# EasyEDA Pro project ProPrj_OSBDM_HPM5301_2024-08-18.epro

# Schematic OSBDM_HPM5301
Board Name: OSBDM_HPM5301
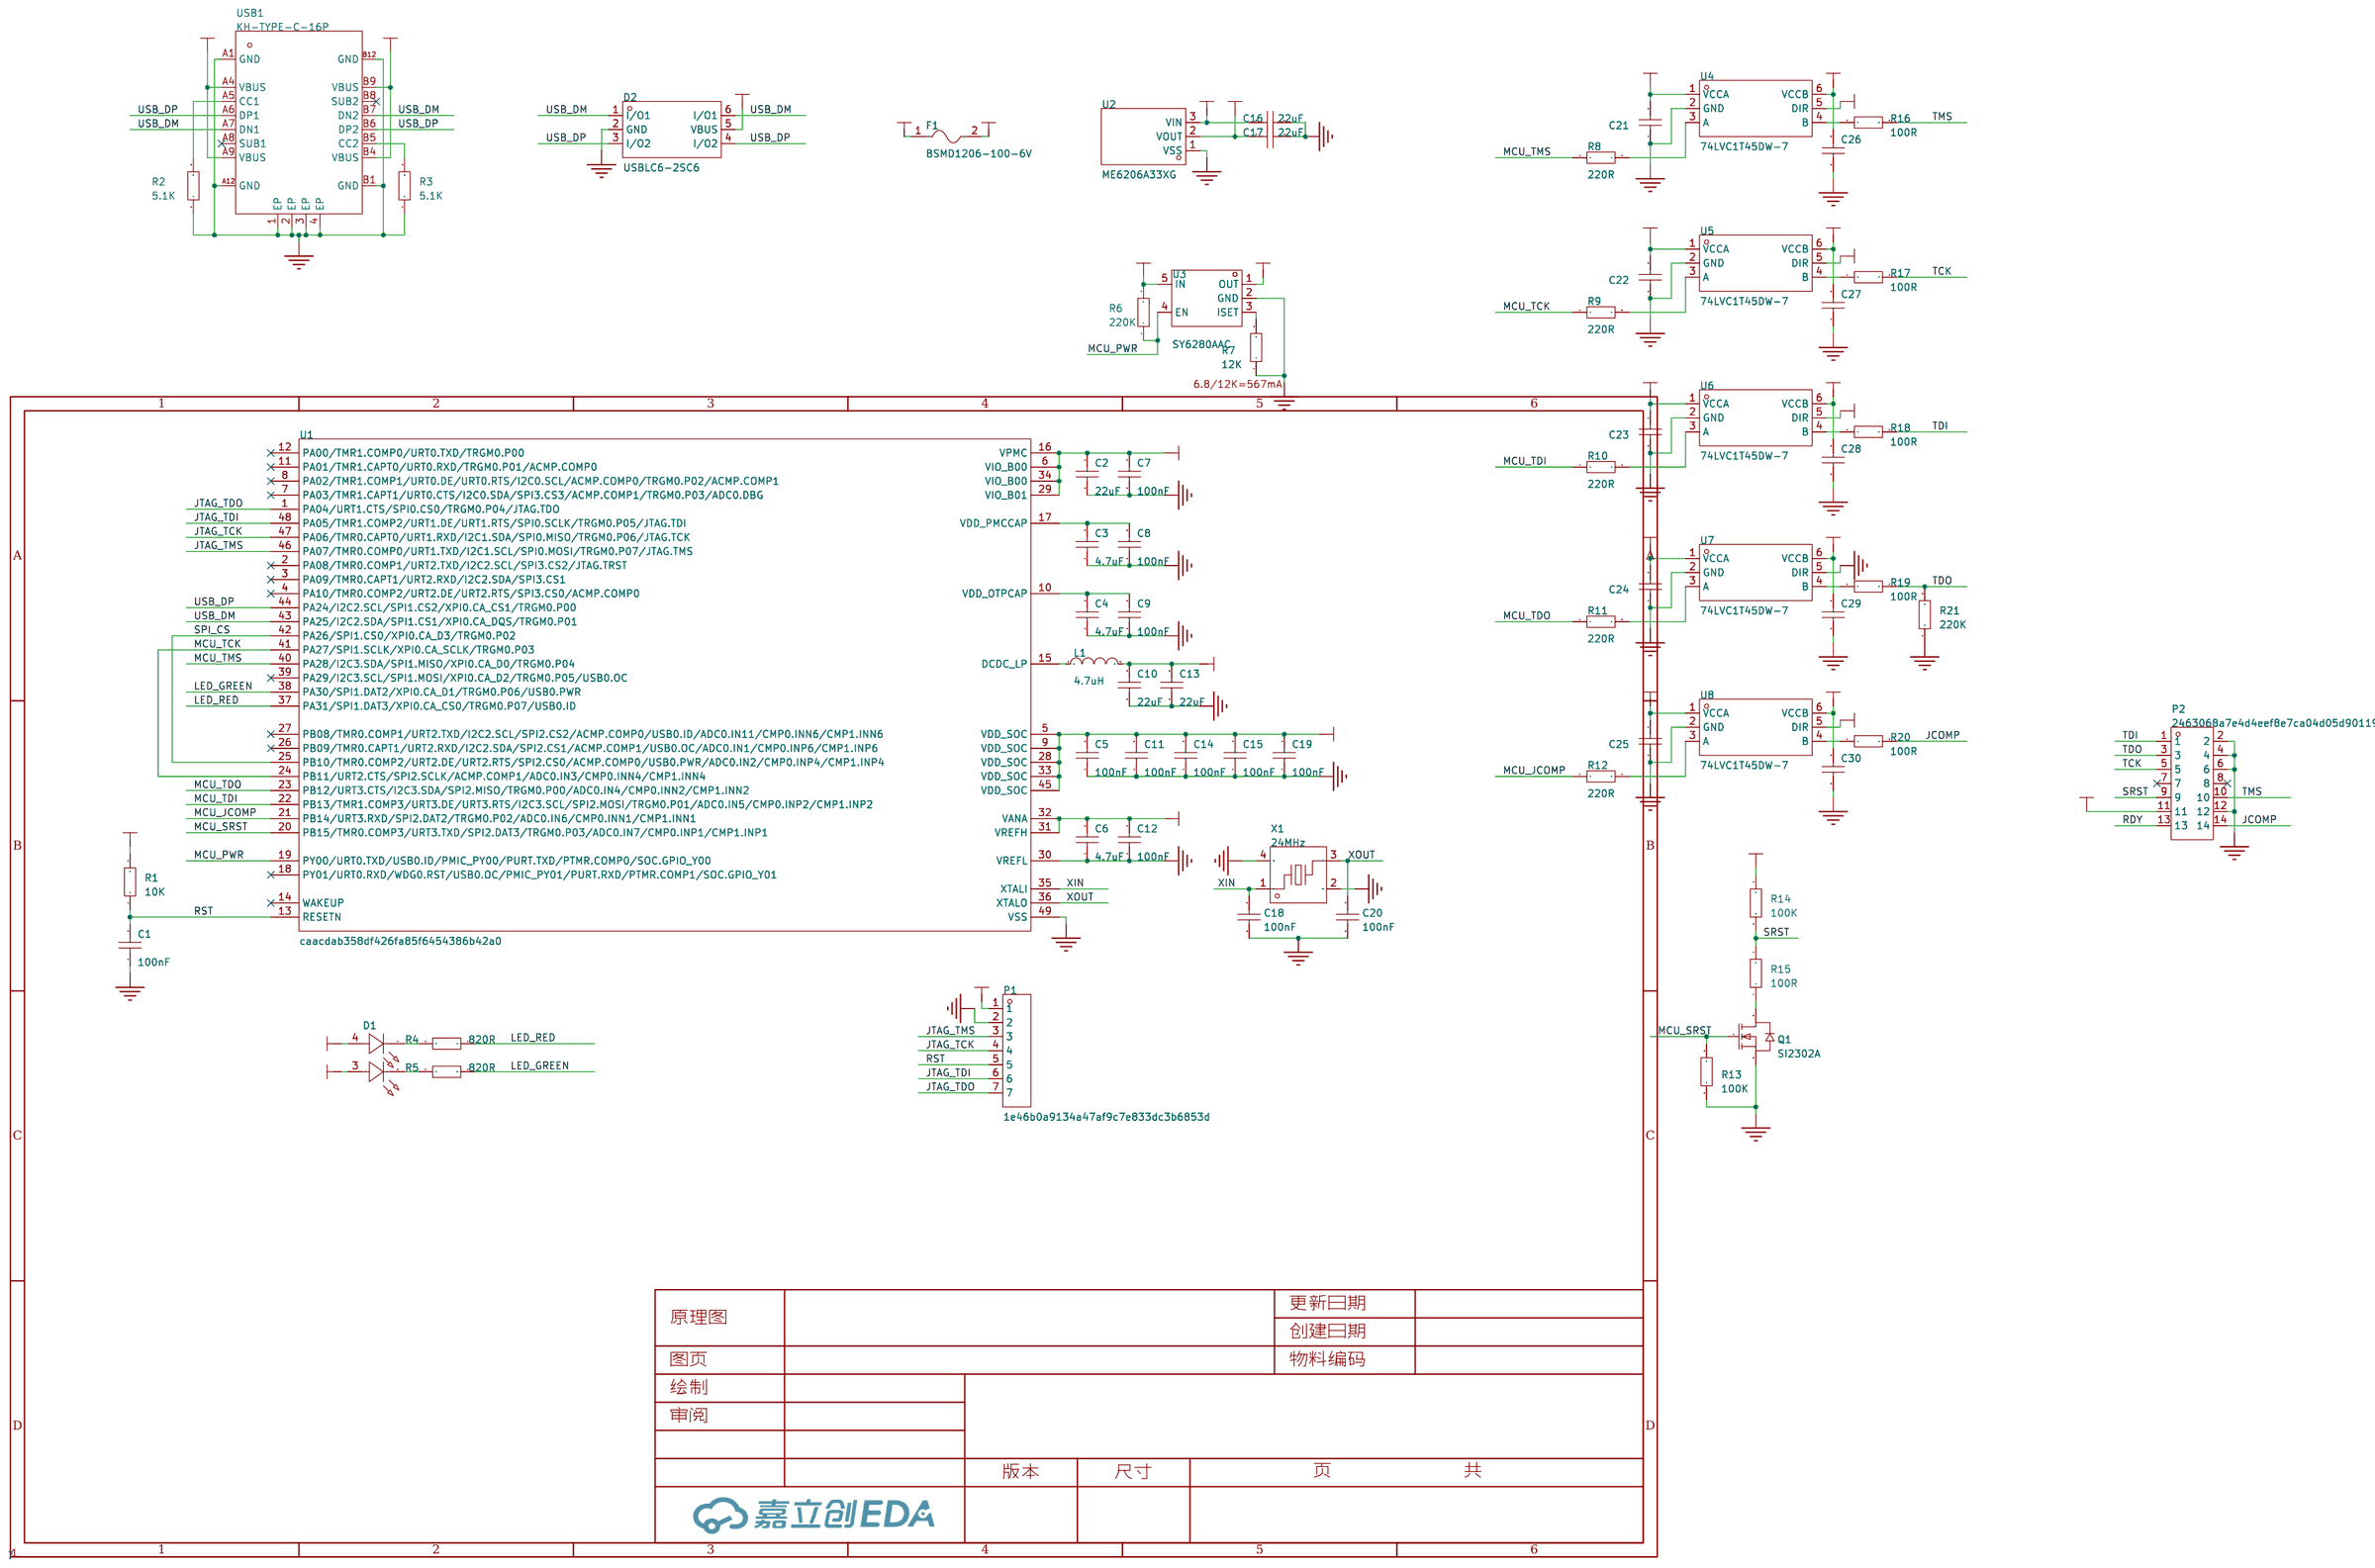
[diagram p0: schematic sheet]

## Parts
C1  100nF  [C0603]
C2  22uF  [C0603]
C3  4.7uF  [C0603]
C4  4.7uF  [C0603]
C5  100nF  [C0603]
C6  4.7uF  [C0603]
C7  100nF  [C0603]
C8  100nF  [C0603]
C9  100nF  [C0603]
C10  22uF  [C0603]
C11  100nF  [C0603]
C12  100nF  [C0603]
C13  22uF  [C0603]
C14  100nF  [C0603]
C15  100nF  [C0603]
C16  22uF  [C0603]
C17  22uF  [C0603]
C18  100nF  [C0603]
C19  100nF  [C0603]
C20  100nF  [C0603]
C21  100nF  [C0603]
C22  100nF  [C0603]
C23  100nF  [C0603]
C24  100nF  [C0603]
C25  100nF  [C0603]
C26  100nF  [C0603]
C27  100nF  [C0603]
C28  100nF  [C0603]
C29  100nF  [C0603]
C30  100nF  [C0603]
D1  -  [LED1615]
D2  USBLC6-2SC6  [SOT-23-6_L2.9-W1.6-P0.95-LS2.8-BL]
F1  BSMD1206-100-6V  [F1206]
L1  4.7uH  [IND-SMD_L2.5-W2.0]
P1  1e46b0a9134a47af9c7e833dc3b6853d  [HDR-TH_7P-P1.27-V-M-1]
P2  2463068a7e4d4eef8e7ca04d05d90119  [IDC-TH_14P-P1.27-H-F-R2-C7-W7.7]
Q1  SI2302A  [SOT-23-3_L2.9-W1.3-P1.90-LS2.4-BR]
R1  10K  [R0603]
R2  5.1K  [R0603]
R3  5.1K  [R0603]
R4  820R  [R0603]
R5  820R  [R0603]
R6  220K  [R0603]
R7  12K  [R0603]
R8  220R  [R0603]
R9  220R  [R0603]
R10  220R  [R0603]
R11  220R  [R0603]
R12  220R  [R0603]
R13  100K  [R0603]
R14  100K  [R0603]
R15  100R  [R0603]
R16  100R  [R0603]
R17  100R  [R0603]
R18  100R  [R0603]
R19  100R  [R0603]
R20  100R  [R0603]
R21  220K  [R0603]
U1  caacdab358df426fa85f6454386b42a0  [QFN-48_L6.0-W6.0-P0.4-BL-EP4.2]
U2  ME6206A33XG  [SOT-23-3_L2.9-W1.6-P1.90-LS2.8-BR]
U3  SY6280AAC  [SOT-23-5_L3.0-W1.7-P0.95-LS2.8-BL]
U4  74LVC1T45DW-7  [SC-70-6_L2.2-W1.3-P0.65-LS2.1-BR]
U5  74LVC1T45DW-7  [SC-70-6_L2.2-W1.3-P0.65-LS2.1-BR]
U6  74LVC1T45DW-7  [SC-70-6_L2.2-W1.3-P0.65-LS2.1-BR]
U7  74LVC1T45DW-7  [SC-70-6_L2.2-W1.3-P0.65-LS2.1-BR]
U8  74LVC1T45DW-7  [SC-70-6_L2.2-W1.3-P0.65-LS2.1-BR]
USB1  KH-TYPE-C-16P  [USB-C-SMD_KH-TYPE-C-16P]
X1  24MHz  [CRYSTAL-SMD_4P-L2.0-W1.6-BL-A]

## Library data of the parts
C1-C30 = C0603
D1 = LED1615
D2 = USBLC6-2SC6: 最大钳位电压:15V;击穿电压:6V;; Supplier Part: C2687116; Manufacturer: UMW(友台半导体); Supplier Footprint: SOT-23-6; JLCPCB Part Class: 扩展库; Datasheet: https://atta.szlcsc.com/upload/public/pdf/source/20231109/512642D850D9873E7C519F71E85B9A10.pdf; Supplier: LCSC; Maximum Clamping Voltage: 15V; Breakdown Voltage: 6V; Number of Lines: 双路; Type: ESD
F1 = BSMD1206-100-6V: 最大电压:6V;最大电流:100A;保持电流:1A;跳闸电流:1.8A;; LCSC Part Name: 1206 1A 6V 国产自恢复; Supplier Part: C883129; Manufacturer: BHFUSE(佰宏); Supplier Footprint: 1206; JLCPCB Part Class: 扩展库; Datasheet: https://atta.szlcsc.com/upload/public/pdf/source/20230512/E419278EC8529AAF514173EF221BCF4B.pdf; Supplier: LCSC; Operating Voltage (Max): 6V; Current Rating (Max): 100A; Hold Current: 1A; Trip Current: 1.8A; Power Dissipation: 800mW; Resistance - Initial (Ri) (Min): 50mΩ; Resistance - Post Trip (R1) (Max): 270mΩ; Maximum Time to Trip: 300ms; Operating Temperature: -40℃~+85℃
L1 = SWPA252012S4R7MT: 电感值:4.7uH;精度:±20%;额定电流:840mA;饱和电流(Isat):1.25A;类型:-;; LCSC Part Name: 4.7uH ±20% 1.25A; Supplier Part: C87640; Manufacturer: Sunlord(顺络); Supplier Footprint: 1008; JLCPCB Part Class: 扩展库; Datasheet: https://atta.szlcsc.com/upload/public/pdf/source/20231024/317626D2AA2F8AB4113C1875E432E6E1.pdf; Supplier: LCSC; Tolerance: ±20%; Rated Current: 840mA; Saturation Current (Isat): 1.25A; DC Resistance (DCR): 377mΩ
P1 = HDR1x7_1.27: LCSC Part Name: 间距:1.27mm 1x7P 直插 方针; Supplier Footprint: 插件,P=1.27mm; Pin Structure: 1x7P; Pitch: 1.27mm; Circluar Pins/Square Pins: 方针; Mounting Type: 直插; Number of Rows: 单排; Number of Pins: 7P; Current Rating (Max): 1A; Length of Mating Pin: 3mm; Insulation Height: 1mm; Length of End Connection Pin: 2.5mm
P2 = IDC1.27-UD2S-7AH4.7: 间距：1.27mm 简牛座 弯插 2x7P 额定电流:1A，耐压:500V,工作温度范围:-40℃~+105℃; LCSC Part Name: 间距1.27 双排 弯插 2*7P  简牛; Supplier Footprint: 弯插,P=1.27mm
Q1 = SI2302A: 类型:N沟道;漏源电压(Vdss):20V;连续漏极电流(Id):2.8A;功率(Pd):1.25W;导通电阻(RDS(on)@Vgs,Id):115mΩ@2.5V,3.1A;阈值电压(Vgs(th)@Id):1.9V@250uA;; LCSC Part Name: N沟道 耐压:20V 电流:2.8A; Supplier Part: C347483; Manufacturer: UMW(友台半导体); Supplier Footprint: SOT-23; JLCPCB Part Class: 扩展库; Datasheet: https://atta.szlcsc.com/upload/public/pdf/source/20231109/A05513FBA15B68C9BEB83ADF1A9CDC8E.pdf; Supplier: LCSC; Type: N沟道; Drain Source Voltage (Vdss): 20V; Continuous Drain Current (Id): 2.8A; Power Dissipation (Pd): 1.25W; Drain Source On Resistance (RDS(on)@Vgs,Id): 115mΩ@2.5V,3.1A; Gate Threshold Voltage (Vgs(th)@Id): 1.9V@250uA; Total Gate Charge (Qg@Vgs): 10nC@4.5V; Input Capacitance (Ciss@Vds): 300pF@10V
R1-R21 = R0603
U1 = HPM5301IEG1
U2 = ME6206A33XG: 输出类型:固定;最大输入电压:6V;输出电压:3.3V;最大输出电流:300mA;电源纹波抑制比(PSRR):50dB@(1kHz);输出极性:正极;; LCSC Part Name: 输入6V 输出3.3V 300mA; Supplier Part: C161345; Manufacturer: MICRONE(南京微盟); Supplier Footprint: SOT-23; JLCPCB Part Class: 扩展库; Datasheet: https://atta.szlcsc.com/upload/public/pdf/source/20180207/C161345_15179949863651359188.pdf; Supplier: LCSC; Output Type: 固定; Maximum Input Voltage: 6V; Output Voltage: 3.3V; MAX Output Current: 300mA; Power Supply Rejection Ratio (PSRR): 50dB@(1kHz); Dropout Voltage: 400mV@(200mA); Output Polarity: 正极; Number of Outputs: 1
U3 = SY6280AAC_C55136: 低能耗配电开关; Supplier Part: C55136; Manufacturer: silergy(矽力杰); Supplier Footprint: SOT-23-5; JLCPCB Part Class: 扩展库; Datasheet: https://atta.szlcsc.com/upload/public/pdf/source/20161108/1478586372822.pdf; Supplier: LCSC
U4-U8 = 74LVC1T45DW-7: 电压(VCCA):1.65V~5.5V;电压(VCCB):1.65V~5.5V;电路数:1;每个电路通道数:1;; Supplier Part: C168855; Manufacturer: DIODES(美台); Supplier Footprint: SC-70-6(SOT-363); JLCPCB Part Class: 扩展库; Datasheet: https://atta.szlcsc.com/upload/public/pdf/source/20180109/C168856_15154706151821250215.pdf; Supplier: LCSC; Channel Type: 双向; Supply Voltage (VCCA): 1.65V~5.5V; Supply Voltage (VCCB): 1.65V~5.5V; Number of Circuits: 1; Channels per Circuit: 1; Output Type: 非反相；三态; Operating Temperature: -40℃~+125℃
USB1 = KH-TYPE-C-16P: 连接器类型:Type-C;标准:-;公母:母座;触点数量:16;端口数量:1;安装方式:卧贴;额定电流 - 电源:3A;工作温度范围:-40~+85;; LCSC Part Name: Type-C 母座 卧贴; Supplier Part: C709357; Manufacturer: kinghelm(金航标); Supplier Footprint: SMD; JLCPCB Part Class: Extended Part; Datasheet: https://atta.szlcsc.com/upload/public/pdf/source/20200911/C709357_AA8DCEB38BB20E3035A7ED7AE7667837.pdf; Supplier: LCSC; Connector Type: Type-C; Gender: 母座; Number of Contacts: 16; Number of Ports: 1; Mounting Style: 卧贴; Current Rating - Power (Max): 3A; Operating Temperature Range: -40~+85
X1 = XL7EL89CKI-111YLC-24M: 晶振类型:贴片晶振;频率:24MHz;常温频差:±10ppm;外接负载电容:8pF;频率稳定度(全温):±20ppm;; LCSC Part Name: 24MHz ±10ppm 8pF; Supplier Part: C2965580; Manufacturer: YXC(扬兴晶振); Supplier Footprint: SMD2016-4P; JLCPCB Part Class: 扩展库; Datasheet: https://atta.szlcsc.com/upload/public/pdf/source/20240329/C26C9A15A73CBCFBF373B30A8E126750.pdf; Supplier: LCSC; Crystal Type: 贴片晶振; Normal temperature Frequency Tolerance: ±10ppm; External load capacitor: 8pF; Frequency Stability(Full temperature range): ±20ppm; Operating Temperature: -40℃~+85℃

## Nets
3.3V: C2.2 C6.2 C7.2 C12.2 C17.2 C21.2 C22.2 C23.2 C24.2 C25.2 D1.3(A) D1.4(A) P1.1 R1.2 U1.6(VIO_B00) U1.16(VPMC) U1.29(VIO_B01) U1.31(VREFH) U1.32(VANA) U1.34(VIO_B00) U2.2(VOUT) U4.1(VCCA) U4.5(DIR) U5.1(VCCA) U5.5(DIR) U6.1(VCCA) U6.5(DIR) U7.1(VCCA) U8.1(VCCA) U8.5(DIR)
5V: C16.2 F1.2 R6.2 U2.3(VIN) U3.5(IN)
GND: C1.1 C2.1 C3.1 C4.1 C5.1 C6.1 C7.1 C8.1 C9.1 C10.1 C11.1 C12.1 C13.1 C14.1 C15.1 C16.1 C17.1 C18.1 C19.1 C20.1 C21.1 C22.1 C23.1 C24.1 C25.1 C26.1 C27.1 C28.1 C29.1 C30.1 D2.2(GND) P1.2 P2.2 P2.4 P2.6 P2.12 Q1.2(S) R2.1 R3.1 R7.1 R13.2 R21.1 U1.30(VREFL) U1.49(VSS) U2.1(VSS) U3.2(GND) U4.2(GND) U5.2(GND) U6.2(GND) U7.2(GND) U7.5(DIR) U8.2(GND) USB1.1(EP) USB1.2(EP) USB1.3(EP) USB1.4(EP) USB1.A1(GND) USB1.A12(GND) USB1.B1(GND) USB1.B12(GND) X1.2(GND) X1.4(GND)
VBUS: D2.5(VBUS) F1.1 USB1.A4(VBUS) USB1.A9(VBUS) USB1.B4(VBUS) USB1.B9(VBUS)
VDD_SOC: C5.2 C10.2 C11.2 C13.2 C14.2 C15.2 C19.2 L1.2 U1.5(VDD_SOC) U1.9(VDD_SOC) U1.28(VDD_SOC) U1.33(VDD_SOC) U1.45(VDD_SOC)
JCOMP: P2.14 R20.2
JTAG_TCK: P1.4 U1.47(PA06/TMR0.CAPT0/URT1.RXD/I2C1.SDA/SPI0.MISO/TRGM0.P06/JTAG.TCK)
JTAG_TDI: P1.6 U1.48(PA05/TMR1.COMP2/URT1.DE/URT1.RTS/SPI0.SCLK/TRGM0.P05/JTAG.TDI)
JTAG_TDO: P1.7 U1.1(PA04/URT1.CTS/SPI0.CS0/TRGM0.P04/JTAG.TDO)
JTAG_TMS: P1.3 U1.46(PA07/TMR0.COMP0/URT1.TXD/I2C1.SCL/SPI0.MOSI/TRGM0.P07/JTAG.TMS)
LED_GREEN: R5.1 U1.38(PA30/SPI1.DAT2/XPI0.CA_D1/TRGM0.P06/USB0.PWR)
LED_RED: R4.1 U1.37(PA31/SPI1.DAT3/XPI0.CA_CS0/TRGM0.P07/USB0.ID)
MCU_JCOMP: R12.1 U1.21(PB14/URT3.RXD/SPI2.DAT2/TRGM0.P02/ADC0.IN6/CMP0.INN1/CMP1.INN1)
MCU_PWR: R6.1 U1.19(PY00/URT0.TXD/USB0.ID/PMIC_PY00/PURT.TXD/PTMR.COMP0/SOC.GPIO_Y00) U3.4(EN)
MCU_SRST: Q1.1(G) R13.1 U1.20(PB15/TMR0.COMP3/URT3.TXD/SPI2.DAT3/TRGM0.P03/ADC0.IN7/CMP0.INP1/CMP1.INP1)
MCU_TCK: R9.1 U1.24(PB11/URT2.CTS/SPI2.SCLK/ACMP.COMP1/ADC0.IN3/CMP0.INN4/CMP1.INN4) U1.41(PA27/SPI1.SCLK/XPI0.CA_SCLK/TRGM0.P03)
MCU_TDI: R10.1 U1.22(PB13/TMR1.COMP3/URT3.DE/URT3.RTS/I2C3.SCL/SPI2.MOSI/TRGM0.P01/ADC0.IN5/CMP0.INP2/CMP1.INP2)
MCU_TDO: R11.1 U1.23(PB12/URT3.CTS/I2C3.SDA/SPI2.MISO/TRGM0.P00/ADC0.IN4/CMP0.INN2/CMP1.INN2)
MCU_TMS: R8.1 U1.40(PA28/I2C3.SDA/SPI1.MISO/XPI0.CA_D0/TRGM0.P04)
RDY: P2.13
RST: C1.2 P1.5 R1.1 U1.13(RESETN)
SPI_CS: U1.25(PB10/TMR0.COMP2/URT2.DE/URT2.RTS/SPI2.CS0/ACMP.COMP0/USB0.PWR/ADC0.IN2/CMP0.INP4/CMP1.INP4) U1.42(PA26/SPI1.CS0/XPI0.CA_D3/TRGM0.P02)
SRST: P2.9 R14.2 R15.2
TCK: P2.5 R17.2
TDI: P2.1 R18.2
TDO: P2.3 R19.2 R21.2
TMS: P2.10 R16.2
USB_DM: D2.1(I/O1) D2.6(I/O1) U1.43(PA25/I2C2.SDA/SPI1.CS1/XPI0.CA_DQS/TRGM0.P01) USB1.A7(DN1) USB1.B7(DN2)
USB_DP: D2.3(I/O2) D2.4(I/O2) U1.44(PA24/I2C2.SCL/SPI1.CS2/XPI0.CA_CS1/TRGM0.P00) USB1.A6(DP1) USB1.B6(DP2)
VREF: C26.2 C27.2 C28.2 C29.2 C30.2 P2.11 R14.1 U3.1(OUT) U4.6(VCCB) U5.6(VCCB) U6.6(VCCB) U7.6(VCCB) U8.6(VCCB)
XIN: C18.2 U1.35(XTALI) X1.1
XOUT: C20.2 U1.36(XTALO) X1.3
$1N2712: C4.2 C9.2 U1.10(VDD_OTPCAP)
$1N3280: L1.1 U1.15(DCDC_LP)
$1N8276: R3.2 USB1.B5(CC2)
$1N8292: R2.2 USB1.A5(CC1)
$1N8964: R16.1 U4.4(B)
$1N8968: R8.2 U4.3(A)
$1N9272: R17.1 U5.4(B)
$1N9276: R9.2 U5.3(A)
$1N9580: R10.2 U6.3(A)
$1N9584: R18.1 U6.4(B)
$1N9863: R19.1 U7.4(B)
$1N10368: R12.2 U8.3(A)
$1N10370: R20.1 U8.4(B)
$1N15287: Q1.3(D) R15.1
$1N15535: R11.2 U7.3(A)
$1N15658: R7.2 U3.3(ISET)
$1N17768: D1.2(K) R5.2
$1N17773: D1.1(K) R4.2
$1N17799: C3.2 C8.2 U1.17(VDD_PMCCAP)

Not connected (* = marked no-connect by the designer): P2 7* 8*; U1 2(PA08/TMR0.COMP1/URT2.TXD/I2C2.SCL/SPI3.CS2/JTAG.TRST)* 3(PA09/TMR0.CAPT1/URT2.RXD/I2C2.SDA/SPI3.CS1)* 4(PA10/TMR0.COMP2/URT2.DE/URT2.RTS/SPI3.CS0/ACMP.COMP0)* 7(PA03/TMR1.CAPT1/URT0.CTS/I2C0.SDA/SPI3.CS3/ACMP.COMP1/TRGM0.P03/ADC0.DBG)* 8(PA02/TMR1.COMP1/URT0.DE/URT0.RTS/I2C0.SCL/ACMP.COMP0/TRGM0.P02/ACMP.COMP1)* 11(PA01/TMR1.CAPT0/URT0.RXD/TRGM0.P01/ACMP.COMP0)* 12(PA00/TMR1.COMP0/URT0.TXD/TRGM0.P00)* 14(WAKEUP)* 18(PY01/URT0.RXD/WDG0.RST/USB0.OC/PMIC_PY01/PURT.RXD/PTMR.COMP1/SOC.GPIO_Y01)* 26(PB09/TMR0.CAPT1/URT2.RXD/I2C2.SDA/SPI2.CS1/ACMP.COMP1/USB0.OC/ADC0.IN1/CMP0.INP6/CMP1.INP6)* 27(PB08/TMR0.COMP1/URT2.TXD/I2C2.SCL/SPI2.CS2/ACMP.COMP0/USB0.ID/ADC0.IN11/CMP0.INN6/CMP1.INN6)* 39(PA29/I2C3.SCL/SPI1.MOSI/XPI0.CA_D2/TRGM0.P05/USB0.OC)*; USB1 A8(SUB1)* B8(SUB2)*

## Notes on the sheet
- 6.8/12K=567mA

# Board OSBDM_HPM5301
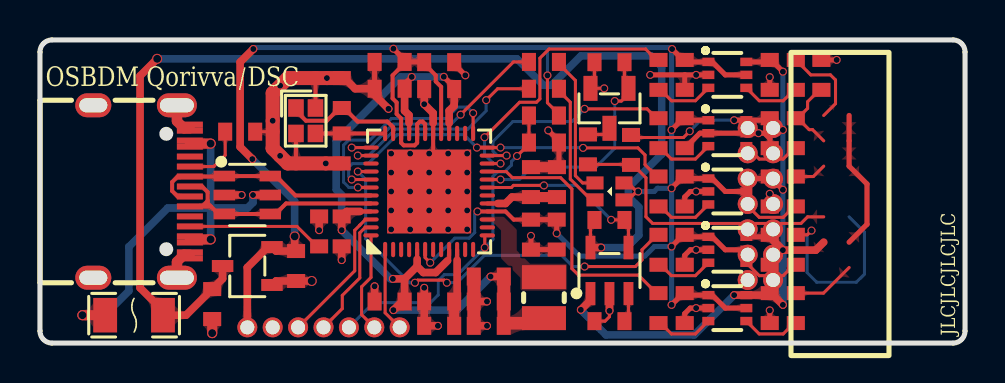
[diagram p1: board, top side]
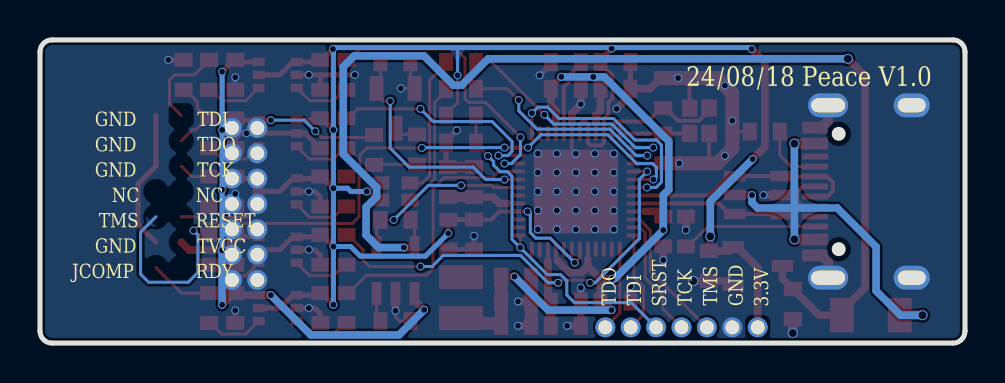
[diagram p2: board, bottom side, seen from below]

Outline 46.25 x 15.19 mm; copper layers: Top Layer, Bottom Layer. Coordinates in mm from the lower left corner of the outline.
Outline path: 0,14.59 0,0.6 arc(0.18,0.18) 0.6,0 45.65,0 arc(46.08,0.18) 46.25,0.6 46.25,14.59 arc(46.08,15.01) 45.65,15.19 0.6,15.19 arc(0.18,15.01) 0,14.59
Stack: Top Layer 0.035mm / Dielectric1 1.51mm FR4 er 4.5 / Bottom Layer 0.035mm

## Design rules (mm)
template: 双面板
spacing copperThickness1oz (default): track to track 0.102, other pairs 0.102 to 0.201
spacing copperThickness2oz: track to track 0.203, other pairs 0.152 to 0.3
track width copperThickness1oz (default): min 0.102, default 0.152, max 2.54
track width copperThickness2oz: min 0.203, default 0.254, max 2.54
differential pair differentialPair (default): width min 0.127, default 0.254, max 2.54; gap min 0.152, default 0.152
via viaSize (default): diameter min 0.399, default 0.399, max 10; hole min 0.3, default 0.3, max 6.299

## Placement (name value [footprint] x y rotation side)
C1  100nF  [C0603]  25.2 10.05 180 top
C2  22uF  [C0603]  25.84 5.44 90 top
C3  4.7uF  [C0603]  25.85 8.07 270 top
C4  4.7uF  [C0603]  19.96 0.86 0 top
C5  100nF  [C0603]  19.96 12.73 0 top
C6  4.7uF  [C0603]  17.48 14.09 0 top
C7  100nF  [C0603]  24.55 5.44 90 top
C8  100nF  [C0603]  24.55 8.07 270 top
C9  100nF  [C0603]  19.96 2.08 0 top
C10  22uF  [C0603]  22.44 0.86 0 top
C11  100nF  [C0603]  17.48 12.74 0 top
C12  100nF  [C0603]  19.96 14.08 180 top
C13  22uF  [C0603]  22.44 2.08 0 top
C14  100nF  [C0603]  15.09 5.59 90 top
C15  100nF  [C0603]  17.48 2.08 0 top
C16  22uF  [C0603]  8.61 1.96 90 top
C17  22uF  [C0603]  12.8 3.86 90 top
C18  100nF  [C0603]  15.09 12.53 270 top
C19  100nF  [C0603]  22.44 3.33 0 top
C20  100nF  [C0603]  15.09 9.75 90 top
C21  100nF  [C0603]  32.24 4.67 90 top
C22  100nF  [C0603]  32.24 7.6 90 top
C23  100nF  [C0603]  32.24 13.44 90 top
C24  100nF  [C0603]  32.24 10.52 90 top
C25  100nF  [C0603]  32.24 1.75 90 top
C26  100nF  [C0603]  36.49 4.67 90 top
C27  100nF  [C0603]  36.49 7.6 90 top
C28  100nF  [C0603]  36.49 13.44 90 top
C29  100nF  [C0603]  36.49 10.52 90 top
C30  100nF  [C0603]  36.49 1.75 90 top
D1  -  [LED1615]  28.48 7.6 0 top
D2  USBLC6-2SC6  [SOT-23-6_L2.9-W1.6-P0.95-LS2.8-BL]  10.37 7.42 270 top
F1  BSMD1206-100-6V  [F1206]  4.7 1.4 0 top
L1  4.7uH  [IND-SMD_L2.5-W2.0]  25.2 2.28 90 top
P1  1e46b0a9134a47af9c7e833dc3b6853d  [HDR-TH_7P-P1.27-V-M-1]  14.18 0.79 0 top
P2  2463068a7e4d4eef8e7ca04d05d90119  [IDC-TH_14P-P1.27-H-F-R2-C7-W7.7]  39.19 11.41 0 top
Q1  SI2302A  [SOT-23-3_L2.9-W1.3-P1.90-LS2.4-BR]  28.48 11.76 90 top
R1  10K  [R0603]  25.2 11.4 0 top
R2  5.1K  [R0603]  10.01 10.59 180 top
R3  5.1K  [R0603]  13.96 5.59 270 top
R4  820R  [R0603]  25.2 14.09 0 top
R5  820R  [R0603]  25.2 12.74 0 top
R6  220K  [R0603]  28.48 6.17 180 top
R7  12K  [R0603]  28.48 1.1 0 top
R8  220R  [R0603]  30.93 4.67 270 top
R9  220R  [R0603]  30.93 7.6 270 top
R10  220R  [R0603]  30.93 13.44 270 top
R11  220R  [R0603]  30.93 10.52 270 top
R12  220R  [R0603]  30.93 1.75 270 top
R13  100K  [R0603]  28.48 14.08 180 top
R14  100K  [R0603]  29.55 9.68 270 top
R15  100R  [R0603]  27.4 9.7 270 top
R16  100R  [R0603]  37.79 4.67 90 top
R17  100R  [R0603]  37.79 7.6 90 top
R18  100R  [R0603]  37.79 13.44 90 top
R19  100R  [R0603]  37.79 10.52 90 top
R20  100R  [R0603]  37.79 1.75 90 top
R21  220K  [R0603]  39.07 13.44 270 top
U1  caacdab358df426fa85f6454386b42a0  [QFN-48_L6.0-W6.0-P0.4-BL-EP4.2]  19.46 7.59 0 top
U2  ME6206A33XG  [SOT-23-3_L2.9-W1.6-P1.90-LS2.8-BR]  10.37 3.86 0 top
U3  SY6280AAC  [SOT-23-5_L3.0-W1.7-P0.95-LS2.8-BL]  28.48 3.63 0 top
U4  74LVC1T45DW-7  [SC-70-6_L2.2-W1.3-P0.65-LS2.1-BR]  34.37 4.67 180 top
U5  74LVC1T45DW-7  [SC-70-6_L2.2-W1.3-P0.65-LS2.1-BR]  34.37 7.6 180 top
U6  74LVC1T45DW-7  [SC-70-6_L2.2-W1.3-P0.65-LS2.1-BR]  34.37 13.44 180 top
U7  74LVC1T45DW-7  [SC-70-6_L2.2-W1.3-P0.65-LS2.1-BR]  34.37 10.52 180 top
U8  74LVC1T45DW-7  [SC-70-6_L2.2-W1.3-P0.65-LS2.1-BR]  34.37 1.75 180 top
USB1  KH-TYPE-C-16P  [USB-C-SMD_KH-TYPE-C-16P]  5.08 7.59 270 top
X1  24MHz  [CRYSTAL-SMD_4P-L2.0-W1.6-BL-A]  13.29 11.14 270 top

## Footprints (pads in the part's own frame, mm; a bottom-side part is the same pattern mirrored in y, then rotated)
C0603
  rect 0.7x0.9 smd: 1(-0.75,0) 2(0.75,0)
CRYSTAL-SMD_4P-L2.0-W1.6-BL-A
  rect 0.875x0.775 smd: 1(-0.638,-0.488) 2(0.638,-0.488) 3(0.638,0.488) 4(-0.638,0.488)
F1206
  rect 1.19x1.728 smd: 1(-1.445,0) 2(1.445,0)
HDR-TH_7P-P1.27-V-M-1
  rrect 1x1 hole 0.7: 1(-3.81,0)
  round 1 hole 0.7: 2(-2.54,0) 3(-1.27,0) 4(0,0) 5(1.27,0) 6(2.54,0) 7(3.81,0)
IDC-TH_14P-P1.27-H-F-R2-C7-W7.7
  rrect 1x1 hole 0.7: 1(-3.801,-0.626)
  round 1 hole 0.7: 2(-2.531,-0.626) 3(-3.801,-1.896) 4(-2.531,-1.896) 5(-3.801,-3.166) 6(-2.531,-3.166) 7(-3.801,-4.436) 8(-2.531,-4.436) 9(-3.801,-5.706) 10(-2.531,-5.706) 11(-3.801,-6.976) 12(-2.531,-6.976) 13(-3.801,-8.246) 14(-2.531,-8.246)
IND-SMD_L2.5-W2.0
  rect 1.2x2.2 smd: 1(1.028,0) 2(-1.028,0)
LED1615
  rect 0.85x0.65 smd: 1(-0.725,0.425) 2(-0.725,-0.425) 3(0.725,-0.425) 4(0.725,0.425)
QFN-48_L6.0-W6.0-P0.4-BL-EP4.2
  oval 0.2x0.765 smd: 1(-2.2,-2.908) 2(-1.8,-2.908) 3(-1.4,-2.908) 4(-1,-2.908) 5(-0.6,-2.908) 6(-0.2,-2.908) 7(0.2,-2.908) 8(0.6,-2.908) 9(1,-2.908) 10(1.4,-2.908) 11(1.8,-2.908) 12(2.2,-2.908) 25(2.2,2.908) 26(1.8,2.908) 27(1.4,2.908) 28(1,2.908) 29(0.6,2.908) 30(0.2,2.908) 31(-0.2,2.908) 32(-0.6,2.908) 33(-1,2.908) 34(-1.4,2.908) 35(-1.8,2.908) 36(-2.2,2.908)
  oval 0.765x0.2 smd: 13(2.908,-2.2) 14(2.908,-1.8) 15(2.908,-1.4) 16(2.908,-1) 17(2.908,-0.6) 18(2.908,-0.2) 19(2.908,0.2) 20(2.908,0.6) 21(2.908,1) 22(2.908,1.4) 23(2.908,1.8) 24(2.908,2.2) 37(-2.908,2.2) 38(-2.908,1.8) 39(-2.908,1.4) 40(-2.908,1) 41(-2.908,0.6) 42(-2.908,0.2) 43(-2.908,-0.2) 44(-2.908,-0.6) 45(-2.908,-1) 46(-2.908,-1.4) 47(-2.908,-1.8) 48(-2.908,-2.2)
  rect 4.2x4.2 smd: 49(0,0)
R0603
  rect 0.7x0.9 smd: 1(-0.75,0) 2(0.75,0)
SC-70-6_L2.2-W1.3-P0.65-LS2.1-BR
  rect 0.6x0.42 smd: 1(0.95,-0.65) 2(0.95,0) 3(0.95,0.65) 4(-0.95,0.65) 5(-0.95,0) 6(-0.95,-0.65)
SOT-23-3_L2.9-W1.3-P1.90-LS2.4-BR
  rect 1.25x0.7 smd: 1(1,-0.95) 2(1,0.95) 3(-1,0)
SOT-23-3_L2.9-W1.6-P1.90-LS2.8-BR
  rect 1.07x0.6 smd: 1(1.235,-0.95) 2(1.235,0.95) 3(-1.235,0)
SOT-23-5_L3.0-W1.7-P0.95-LS2.8-BL
  rect 0.49x1.157 smd: 1(-0.95,-1.153) 2(0,-1.153) 3(0.95,-1.153)
  rect 0.49x1.175 smd: 4(0.95,1.153) 5(-0.95,1.153)
SOT-23-6_L2.9-W1.6-P0.95-LS2.8-BL
  rect 0.532x1.072 smd: 1(-0.95,-1.149) 2(0,-1.149) 3(0.95,-1.149) 4(0.95,1.149) 5(0,1.149) 6(-0.95,1.149)
USB-C-SMD_KH-TYPE-C-16P
  oval 1.2x2 hole 0.7x1.7: 1(-4.32,1.765) 2(4.32,1.765)
  oval 1.2x1.8 hole 0.7x1.4: 3(-4.32,-2.415) 4(4.32,-2.415)
  rect 0.3x1.3 smd: A1(-3.35,2.415) A4(-2.55,2.415) A5(-1.25,2.415) A6(-0.25,2.415) A7(0.25,2.415) A8(1.25,2.415) A9(2.55,2.415) A12(3.35,2.415) B1(3.05,2.415) B4(2.25,2.415) B5(1.75,2.415) B6(0.75,2.415) B7(-0.75,2.415) B8(-1.75,2.415) B9(-2.25,2.415) B12(-3.05,2.415)

## Nets
As in the schematic.

Pads without a net: P2 7 8; U1 2 3 4 7 8 11 12 14 18 26 27 39; USB1 A8 B8

## Via types
v1: diameter 0.4, hole 0.3, Top Layer to Bottom Layer, 111 vias
v2: diameter 0.5, hole 0.4, Top Layer to Bottom Layer, 7 vias

## Routing (per net, layer and track width the routed paths; a pad name or vN(x,y) marks a point on that pad's centre or on a via; arc(x,y) is an arc through that point)
3.3V: length 106.7
  Top Layer w0.152: U1.16 v1(21.87,6.59) ; 29.2,7.16 29.4,7.16 29.83,7.59 29.4,8.02 D1.4 ; v1(25.37,13.41) 25.37,12.04 25.95,11.46 R1.2 ; U1.6 19.26,4.28 v1(19.51,4.03)
  Top Layer w0.201: C12.2 19.21,13.99 19.79,13.41 19.79,13.11 20.06,12.84 U1.29 ; U1.31 19.26,10.97 19.13,11.1 18.99,11.1 18.86,10.97 U1.32 18.86,10.03 18.73,9.91 18.19,9.91 18.06,10.03 U1.34 18.06,11.26 17.83,11.48 17.83,12.06 17.63,12.26 17.63,13.41 18.23,14.01 C6.2 ; C7.2 23.69,6.19 23.28,6.59 U1.16
  Top Layer w0.254: U5.5 34.27,7.6 33.62,8.25 U5.1 32.34,8.25 C22.2 32.17,8.35 v1(31.58,7.76) ; v1(31.58,10.68) 32.17,11.27 C24.2 32.34,11.17 U7.1 ; v1(31.61,14.73) 32.15,14.19 C23.2 32.34,14.09 U6.1 33.62,14.09 34.27,13.44 U6.5 ; v1(31.58,1.92) 32.17,2.5 C25.2 32.34,2.4 U8.1 33.62,2.4 34.27,1.75 U8.5 ; v1(17.67,14.75) 18.23,14.19 C6.2 19.2,14.09 C12.2 ; C7.2 C2.2 v1(25.84,5.5) ; U4.5 34.27,4.67 33.62,5.32 U4.1 32.34,5.32 C21.2 32.17,5.42 v1(31.58,4.84)
  Top Layer w0.381: v1(10.67,14.73) 10.01,14.08 10.01,9.83 v1(10.62,9.22) ; v2(12.73,5.34) 12.73,4.68 C17.2 11.8,4.61 U2.2 11.39,4.81 10.37,3.79 P1.1
  Bottom Layer w0.152: v1(21.87,6.59) 21.74,6.46 21.74,5.54 21.46,5.26 20.74,5.26 v1(19.51,4.03) ; v1(25.37,13.41) 25.37,14.81
  Bottom Layer w0.254: v1(31.58,4.84) v1(31.58,1.92) ; v1(31.58,4.84) 30.72,4.84 30.24,4.36 26.98,4.36 v1(25.84,5.5) ; v1(31.58,4.84) v1(31.58,7.76) ; 10.74,14.81 31.53,14.81 v1(31.61,14.73) 31.58,14.71 v1(31.58,10.68) v1(31.58,7.76) ; 10.74,14.81 10.67,14.81 ; 10.74,14.81 v1(10.67,14.73) ; v1(31.58,7.76) 30.87,7.76 30.71,7.59 v1(29.91,7.59)
  Bottom Layer w0.381: v1(10.62,9.22) 12.73,7.1 v2(12.73,5.34)
5V: length 58.1
  Top Layer w0.152: R6.2 27.53,5.97 U3.5
  Top Layer w0.381: 9.13,3.86 9.13,3.23 C16.2 7.3,1.4 F1.2 6.15,1.62 5,2.77 5,13.39 v2(5.86,14.24) ; v1(28.06,4.79) U3.5
  Bottom Layer w0.381: v2(5.86,14.24) 23.85,14.24 25.17,12.92 25.58,12.92 27.05,14.39 30.54,14.39 31.09,13.84 31.09,9.47 29.42,7.8 29.42,7.33 29.95,6.81 29.95,5.41 29.32,4.79 v1(28.06,4.79)
GND: length 72.3
  Top Layer w0.152: R13.2 27.73,12.96 Q1.2 v1(28.21,12.76) ; v1(28.48,1.62) 28.48,1.32 28.25,1.1 R7.1 ; R2.1 11.64,10.59
  Top Layer w0.201: 19.66,11.03 U1.30 19.66,9.5 ; X1.2 12.8,9 ; X1.4 13.78,13.28
  Top Layer w0.254: 36.5,9.77 36.5,10.24 36.22,10.52 v1(35.93,10.52) U7.5 U7.2 33,10.52 32.25,9.77 C24.1 ; v1(36.49,4.56) C26.1 ; C6.1 C11.1 ; C21.1 32.24,4.4 32.51,4.67 v1(32.81,4.67) U4.2 ; v1(24.55,5.37) C7.1 C2.1 ; C25.1 32.24,1.48 32.51,1.75 v1(32.81,1.75) U8.2 ; 32.24,13.44 C23.1 ; 32.24,13.44 v1(32.81,13.44) U6.2 ; 32.24,13.44 v1(30.51,13.44) ; v1(39.84,14.19) R21.1 ; v1(21.27,13.41) 20.71,13.97 C12.1 ; 40.46,5.05 41.35,5.95 41.35,7.97 40.46,8.86 40.46,11.41 ; v1(25.42,10.66) 25.95,10.12 C1.1 25.95,8.92 C3.1 ; v1(36.49,7.48) C27.1 ; C22.1 32.24,7.32 32.51,7.6 v1(32.81,7.6) U5.2 ; v1(36.49,13.32) C28.1 ; v1(36.49,1.64) C30.1
  Top Layer w0.381: v1(19.21,2.77) C9.1 C4.1 v1(19.9,0.86) ; v1(15.09,4.16) C14.1 ; v2(13.59,3.11) C17.1 11.8,3.11 U2.1 ; v1(16.73,2.85) C15.1 ; C5.1 v1(19.21,11.97) 19.66,11.52 19.66,11.03 ; v1(10.08,7.42) D2.2 ; v1(28.48,1.62) U3.2 ; v1(13.96,5.66) R3.1 ; v1(22.35,0.86) C10.1 ; v1(17.43,11.74) 16.73,12.43 C11.1 15.76,12.74 15.22,13.28 C18.1 ; v1(22.35,2.08) C13.1
  Top Layer w0.508: 6.84,3.27 6.84,4.07 7.2,4.43 7.5,4.43 ; C8.1 C3.1 ; USB1.1 6.84,11.12 7.2,10.76 7.5,10.76 ; C16.1 v2(8.61,0.5)
  Top Layer w0.635: C19.1 C13.1 C10.1
  Top Layer w0.701: 11.64,9.76 v1(11.64,11.14) 11.64,12.52 12.39,13.28 v1(14.35,13.28) C18.1 ; 11.63,9.76 v1(12.01,9.38) 12.39,9 v1(14.29,9) C20.1
  vias: v1(12.01,12.9) v1(17.56,9.5) v1(17.56,8.55) v1(17.56,7.59) v1(17.56,6.64) v1(17.56,5.69) v1(18.51,9.5) v1(18.51,8.55) v1(18.51,7.59) v1(18.51,6.64) v1(18.51,5.69) v1(19.46,9.5) v1(19.46,8.55) v1(19.46,7.59) v1(19.46,6.64) v1(19.46,5.69) v1(20.41,9.5) v1(20.41,8.55) v1(20.41,7.59) v1(20.41,6.64) v1(20.41,5.69) v1(21.36,9.5) v1(21.36,8.55) v1(21.36,7.59) v1(21.36,6.64) v1(21.36,5.69)
VBUS: length 21.4
  Top Layer w0.381: v1(10.65,7.42) D2.5
  Top Layer w0.508: 7.49,5.19 v2(8.53,5.19) ; 7.5,10 v2(8.53,10) ; F1.1 v2(2.12,1.4)
  Bottom Layer w0.381: v2(2.12,1.4) 3.23,1.4 4.44,2.62 4.44,4.83 6.39,6.77 8.53,6.77 ; v1(10.65,7.42) 10.65,7.04 10.38,6.77 8.53,6.77 ; 8.53,6.77 v2(8.53,5.19) ; 8.53,6.77 v2(8.53,10)
VDD_SOC: length 40.3
  Top Layer w0.201: 20.42,4.08 20.46,4.12 U1.9 ; 18.86,4.2 U1.5 ; 20.46,11.02 U1.28 ; 16,6.59 U1.45 ; 18.46,11.03 U1.33
  Top Layer w0.254: v1(18.59,13.34) 18.23,12.98 C11.2 ; C5.2 20.71,12.82 v1(20.19,13.34)
  Top Layer w0.381: 18.86,3.85 19.17,3.53 19.79,3.53 20.38,4.12 ; 18.86,3.85 18.23,3.22 ; 18.86,3.85 18.86,4.2 ; C5.2 20.71,11.89 20.46,11.64 20.46,11.02 ; v1(17.65,3.22) 18.23,3.22 ; 18.23,3.22 C15.2 18.1,2.08 v1(17.67,1.65) ; v1(22.53,3.33) C19.2 ; 16,6.59 15.34,6.59 C14.2 v1(15.09,5.66) ; C11.2 18.23,11.64 18.45,11.42 18.45,11.04
  Top Layer w0.635: 23.19,0.99 C13.2 C19.2 ; 23.19,0.99 C10.2 ; 23.19,0.99 24.81,0.99
  Bottom Layer w0.381: v1(22.53,3.33) 20.85,1.65 v1(17.67,1.65) ; v1(20.19,13.34) 20.18,13.34 v1(18.59,13.34) 18.03,13.34 14.81,10.11 14.81,7.69 15.09,7.42 v1(15.09,5.66) 17.53,3.22 v1(17.65,3.22)
JCOMP: length 3.2
  Top Layer w0.152: R20.2 39.18,2.5 40.46,3.78
JTAG_TCK: length 6.2
  Top Layer w0.152: U1.47 16.26,5.8 15.99,5.52 15.99,3.26 15.12,2.39 15.12,1.73 P1.4
JTAG_TDI: length 5.1
  Top Layer w0.152: P1.6 16.08,1.42 16.08,2.82 16.55,3.29 U1.48
JTAG_TDO: length 4.2
  Top Layer w0.152: 17.26,4.69 17.26,1.52 P1.7
JTAG_TMS: length 7.1
  Top Layer w0.152: U1.46 16.28,6.19 15.99,5.91 15.99,5.91 15.74,5.65 15.74,3.62 P1.3
LED_GREEN: length 10.9
  Top Layer w0.152: R5.1 22.88,12.74 v1(22.31,12.17) ; U1.38 v1(15.89,9.39)
  Bottom Layer w0.152: v1(22.31,12.17) 22.31,11.64 21.39,10.72 17.76,10.72 16.44,9.39 v1(15.89,9.39)
LED_RED: length 11.6
  Top Layer w0.152: R4.1 23.67,14.09 v1(21.03,11.44) ; U1.37 v1(15.59,9.8)
  Bottom Layer w0.152: v1(21.03,11.44) 20.56,10.97 17.66,10.97 16.48,9.8 v1(15.59,9.8)
MCU_JCOMP: length 13.4
  Top Layer w0.152: R12.1 30.82,2.5 29.92,3.4 26.93,3.4 26.6,3.73 26.6,7.72 26.03,8.29 23.62,8.29 23.31,8.59 U1.21
MCU_PWR: length 9.1
  Top Layer w0.152: v1(25.2,7.9) 23.68,7.9 23.57,7.8 U1.19 ; v1(28.56,6.18) 29.22,6.18 R6.1 29.43,5.97 U3.4
  Bottom Layer w0.152: v1(25.2,7.9) 26.84,7.9 v1(28.56,6.18)
MCU_SRST: length 11.9
  Top Layer w0.152: R13.1 29.23,12.96 Q1.1 29.43,12.48 29.07,12.13 v1(28.74,12.13) ; U1.20 v1(23.03,8.19)
  Bottom Layer w0.152: v1(28.74,12.13) 28.74,9.76 27.79,8.81 24.59,8.81 23.97,8.19 v1(23.03,8.19)
MCU_TCK: length 19
  Top Layer w0.152: U1.41 v1(15.59,8.19) ; v1(27.16,9.78) 29.9,9.78 30.25,9.42 30.25,8.94 30.85,8.35 R9.1 ; v1(23.03,9.8) U1.24 v1(21.85,9.8)
  Bottom Layer w0.152: v1(21.85,9.8) 21.2,10.44 17.86,10.44 16.41,8.99 15.62,8.99 15.43,8.8 15.43,8.35 v1(15.59,8.19) ; v1(23.03,9.8) 27.14,9.8 v1(27.16,9.78)
MCU_TDI: length 14.5
  Top Layer w0.152: v1(22.23,10.31) 23.98,12.07 24.82,12.07 25,12.24 25,14.28 25.45,14.73 30.28,14.73 30.82,14.19 R10.1 ; U1.22 v1(23.03,9)
  Bottom Layer w0.152: v1(23.03,9) 22.68,9 22.23,9.45 v1(22.23,10.31)
MCU_TDO: length 11.4
  Top Layer w0.152: R11.1 30.82,11.27 30.36,11.74 v1(27.23,11.74) ; U1.23 v1(23.33,9.39)
  Bottom Layer w0.152: v1(27.23,11.74) 26.6,11.1 23.65,11.1 22.65,10.1 22.65,9.61 22.87,9.39 v1(23.33,9.39)
MCU_TMS: length 21.6
  Top Layer w0.152: v1(27.23,3.84) 29.77,3.84 30.1,4.17 30.1,4.67 30.85,5.42 R8.1 ; U1.40 v1(15.89,8.59) ; v1(20.34,3.02) 20.21,3.15 18.88,3.15 v1(18.75,3.02)
  Bottom Layer w0.152: v1(27.23,3.84) 26.64,3.84 26.09,4.39 22.22,4.39 20.85,3.02 v1(20.34,3.02) ; v1(18.75,3.02) 18.49,3.02 16.28,5.23 16.28,8.2 v1(15.89,8.59)
RST: length 17.3
  Top Layer w0.152: v1(23.85,9.37) 24.45,9.97 C1.2 R1.1 ; U1.13 22.24,5.39 v1(22.24,4.79)
  Bottom Layer w0.152: v1(23.85,9.37) 23.57,9.09 23.57,8.92 23.24,8.59 22.88,8.59 22.65,8.35 22.65,5.19 v1(22.24,4.79) 20.88,3.43 20.22,3.43 19.91,3.13 19.91,2.41 19.53,2.03 16.69,2.03 P1.5
SPI_CS: length 11.7
  Top Layer w0.152: v1(15.9,7.8) 16.55,7.8 U1.42 ; U1.25 v1(21.66,11.52)
  Bottom Layer w0.152: 21.66,11.52 21.35,11.82 20.88,11.82 20.31,11.25 17.58,11.25 16.5,10.17 15.43,10.17 15.18,9.92 15.18,8.06 15.45,7.8 v1(15.9,7.8)
SRST: length 14.3
  Top Layer w0.152: R15.2 29.53,8.95 R14.2 29.66,8.93 30.3,8.29 30.3,6.33 30.63,6 38.05,6 38.38,6.33 39.19,6.33
TCK: length 1.6
  Top Layer w0.152: R17.2 38.67,8.35 39.19,8.86
TDI: length 4.4
  Top Layer w0.152: R18.2 38.54,13.44 39.53,13.44 39.78,13.18 39.78,12 39.19,11.41
TDO: length 3.8
  Top Layer w0.152: 39.19,10.13 38.63,10.69 38.46,10.69 37.89,11.27 ; R21.2 38.98,12.69 38.38,12.09 38.38,11.76 37.89,11.27 ; 37.89,11.27 R19.2
TMS: length 9.5
  Top Layer w0.152: R16.2 38.36,5.42 v1(38.58,5.64)
  Bottom Layer w0.152: v1(38.58,5.64) 38.36,5.42 38.36,3.53 38.84,3.05 40.82,3.05 41.23,3.45 41.23,5.56 40.46,6.33
USB_DM: length 11.7
  Top Layer w0.201: U1.43 12.77,7.39 11.8,8.37 D2.6 D2.1 9.19,8.34 7.75,8.34 ; 7.5,8.34 6.88,8.34 6.61,8.07 6.61,7.62 6.88,7.34 7.5,7.34
USB_DP: length 12.2
  Top Layer w0.201: 7.5,7.84 8.11,7.84 8.38,7.57 8.38,7.12 ; 8.55,6.84 7.5,6.84 8.11,6.84 8.38,7.12 ; 8.55,6.84 8.92,6.47 D2.3 D2.4 11.78,6.47 12.3,7 U1.44 ; 8.55,6.84 8.38,7.01 8.38,7.12
VREF: length 41.4
  Top Layer w0.152: R14.1 29.68,10.3 32.18,10.3 v1(32.49,10.61)
  Top Layer w0.254: v1(37.15,10.68) 36.56,11.27 C29.2 36.39,11.17 U7.6 v1(34.71,11.17) ; U5.6 36.39,8.25 C27.2 36.49,8.34 v1(37.15,7.68) ; v1(37.15,13.6) 36.56,14.19 C28.2 36.39,14.09 U6.6 ; U4.6 36.39,5.32 C26.2
  Top Layer w0.381: U3.1 27.53,2.15 v1(27.04,1.67) ; v1(34.71,2.4) U8.6 36.39,2.4 C30.2 36.56,2.5 v1(37.15,1.92) ; 39.19,5.05 38.79,4.66 v1(37.15,4.66) 36.49,5.32 C26.2
  Bottom Layer w0.152: v1(34.71,11.17) 33.04,11.17 v1(32.49,10.61)
  Bottom Layer w0.254: v1(37.15,13.6) v1(37.15,10.68) v1(37.15,7.68) v1(37.15,4.66)
  Bottom Layer w0.381: v1(37.15,4.66) v1(37.15,1.92) ; v1(27.04,1.67) 28.3,0.41 32.71,0.41 v1(34.71,2.4)
XIN: length 6.2
  Top Layer w0.198: C18.2 14.98,11.78 14.34,11.14 13.3,11.14 12.8,11.64 X1.1
  Top Layer w0.201: U1.35 17.66,10.81 17.37,11.1 15.88,11.1 15.2,11.78 C18.2
XOUT: length 3.5
  Top Layer w0.201: U1.36 C20.2 X1.3
$1N2712: length 3.9
  Top Layer w0.201: 20.86,4.15 U1.10
  Top Layer w0.381: 20.86,4.15 20.86,2.23 C9.2
  Top Layer w0.508: C4.2 C9.2
$1N8276: length 6.9
  Top Layer w0.152: R3.2 13.85,4.84 12.85,5.84 7.5,5.84
$1N8292: length 3.2
  Top Layer w0.152: 7.5,8.84 8.69,8.84 9.26,9.41 R2.2
$1N8964: length 3
  Top Layer w0.152: 37.81,3.92 37.71,3.92 37.16,3.38 35.96,3.38 U4.4
$1N8968: length 3
  Top Layer w0.152: R8.2 31.03,3.92 31.57,3.38 32.77,3.38 U4.3
$1N9272: length 3
  Top Layer w0.152: 37.81,6.85 37.71,6.85 37.16,6.3 35.96,6.3 U5.4
$1N9276: length 3
  Top Layer w0.152: U5.3 32.77,6.3 31.57,6.3 31.03,6.85 R9.2
$1N9580: length 3
  Top Layer w0.152: R10.2 31.03,12.69 31.57,12.14 32.77,12.14 U6.3
$1N9584: length 3
  Top Layer w0.152: U6.4 35.96,12.14 37.16,12.14 37.71,12.69 37.81,12.69
$1N9863: length 3
  Top Layer w0.152: 37.81,9.77 37.71,9.77 37.16,9.22 35.96,9.22 U7.4
$1N10368: length 3
  Top Layer w0.152: R12.2 31.03,1 31.57,0.46 32.77,0.46 U8.3
$1N10370: length 3
  Top Layer w0.152: 37.81,1 37.71,1 37.16,0.46 35.96,0.46 U8.4
$1N15287: length 1.2
  Top Layer w0.152: R15.1 28.17,10.45 Q1.3
$1N15535: length 3
  Top Layer w0.152: U7.3 32.77,9.22 31.57,9.22 31.03,9.77 R11.2
$1N15658: length 1.5
  Top Layer w0.152: U3.3 29.43,1.3 R7.2
$1N17768: length 6.4
  Top Layer w0.152: R5.2 25.95,12.64 26.52,12.07 26.52,8.22 27.56,7.17 D1.2
$1N17773: length 7.2
  Top Layer w0.152: D1.1 27.13,8.02 26.77,8.38 26.77,13.16 25.95,13.98 R4.2
$1N17799: length 3.6
  Top Layer w0.201: 22.89,7 U1.17
  Top Layer w0.381: C8.2 23.6,7.32 23.28,7 22.89,7
  Top Layer w0.508: C8.2 C3.2

## Copper pours and planes (outline as drawn; the poured copper is in the pictures)
GND on Bottom Layer: 0.18,15.19 46.25,15.19 46.25,0 0.18,0
$1N3280 on Top Layer: 22.08,6.3 23.17,6.3 23.8,5.66 23.8,4.62 24.49,3.94 26.29,3.94 26.32,3.91 26.32,2.72 26.27,2.67 24.11,2.67 24.06,2.72 24.06,3.29 23.09,4.26 23.09,5.66 22.66,6.09 22.08,6.09

Small or netless copper shapes (teardrops, artwork), in the pictures only: 374 on Top Layer, 76 on Bottom Layer

## Text on the board
Bottom Silkscreen Layer: 3.3V | GND | TMS | TCK | SRST | TDI | TDO | TVCC | NC | RESET | RDY | JCOMP | 24/08/18 Peace V1.0
Top Silkscreen Layer: JLCJLCJLCJLC | OSBDM Qorivva/DSC
